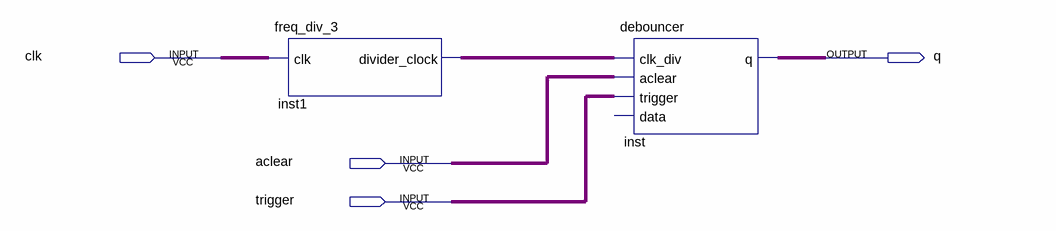
[diagram p0: schematic sheet]
// Quartus schematic h7_1.bdf as structural Verilog: 2 symbols, 4 pins
module h7_1 (
  input  clk,
  input  aclear,
  input  trigger,
  output q
);

  wire inst1_divider_clock;

  freq_div_3 inst1 (.clk(clk), .divider_clock(inst1_divider_clock));
  debouncer inst (.clk_div(inst1_divider_clock), .aclear(aclear), .trigger(trigger), .q(q));  // open: data
endmodule
